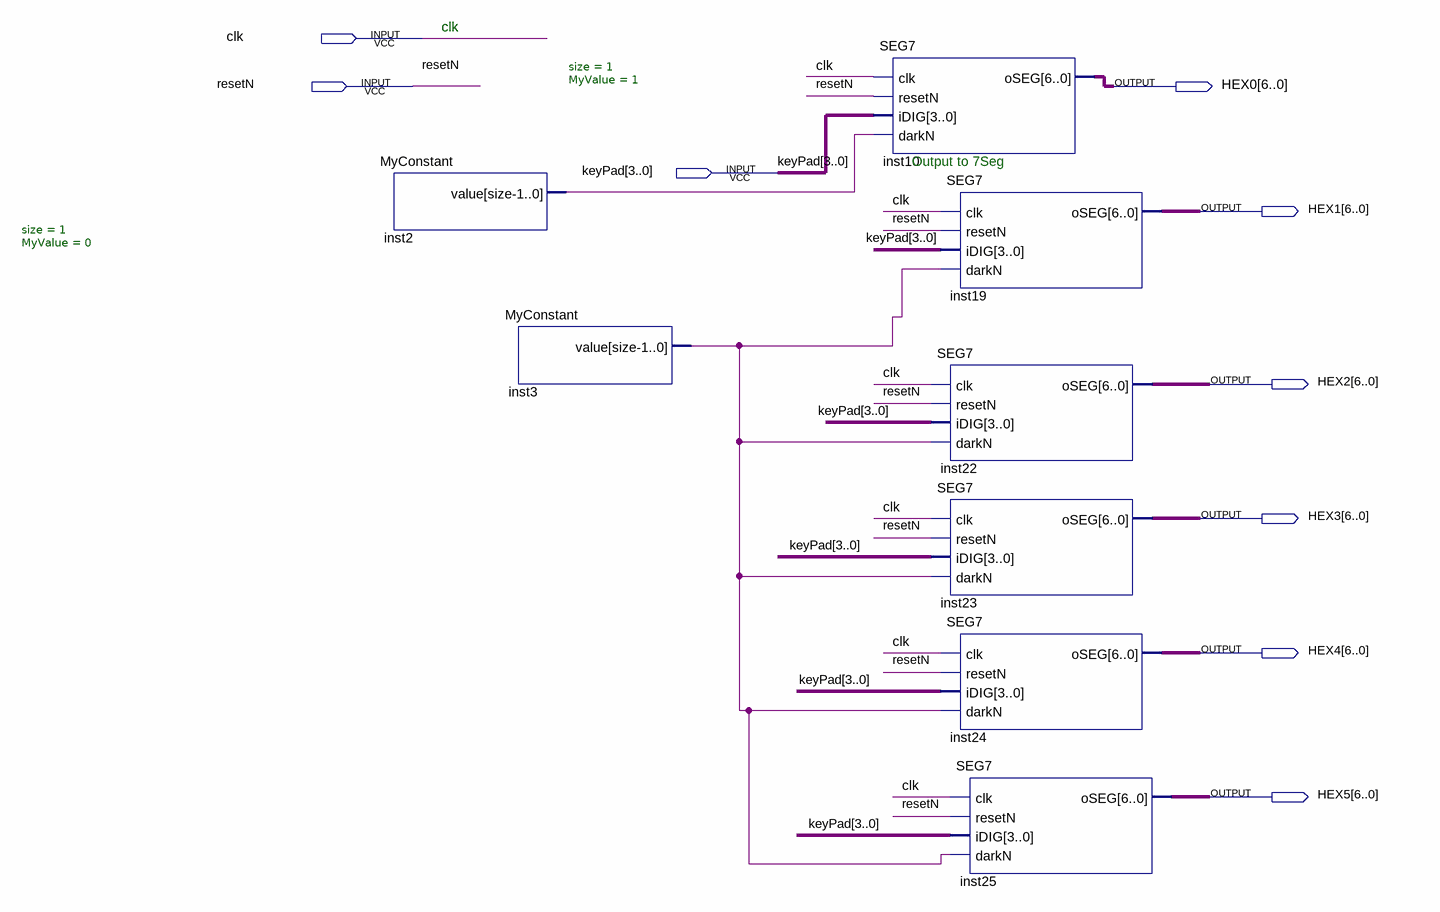
[diagram p0: schematic sheet]
// Quartus schematic ALL_HEXSS.bdf as structural Verilog: 8 symbols, 9 pins
module ALL_HEXSS (
  input  clk,
  input  resetN,
  input  [3:0] keyPad,
  output [6:0] HEX0,
  output [6:0] HEX1,
  output [6:0] HEX2,
  output [6:0] HEX3,
  output [6:0] HEX4,
  output [6:0] HEX5
);

  wire inst2_value, inst3_value;

  MyConstant #(.size(1), .MyValue(1)) inst2 (.value(inst2_value));
  MyConstant #(.size(1), .MyValue(0)) inst3 (.value(inst3_value));
  SEG7 inst10 (.clk(clk), .resetN(resetN), .iDIG(keyPad), .darkN(inst2_value), .oSEG(HEX0));
  SEG7 inst22 (.clk(clk), .resetN(resetN), .iDIG(keyPad), .darkN(inst3_value), .oSEG(HEX2));
  SEG7 inst23 (.clk(clk), .resetN(resetN), .iDIG(keyPad), .darkN(inst3_value), .oSEG(HEX3));
  SEG7 inst19 (.clk(clk), .resetN(resetN), .iDIG(keyPad), .darkN(inst3_value), .oSEG(HEX1));
  SEG7 inst24 (.clk(clk), .resetN(resetN), .iDIG(keyPad), .darkN(inst3_value), .oSEG(HEX4));
  SEG7 inst25 (.clk(clk), .resetN(resetN), .iDIG(keyPad), .darkN(inst3_value), .oSEG(HEX5));

  // Notes on the sheet:
  //   clk
  //   Output to 7Seg
endmodule
